# EasyEDA schematic SCH_Octoslime_2022-08-10_Schematics.json

## Sheets
1 I2C breakout and OLED: TITLE: I2C expander to RJ45 and OLED; REV: 1.0; Date: 2022-07-19; Sheet: 1/4; Company: Your Company
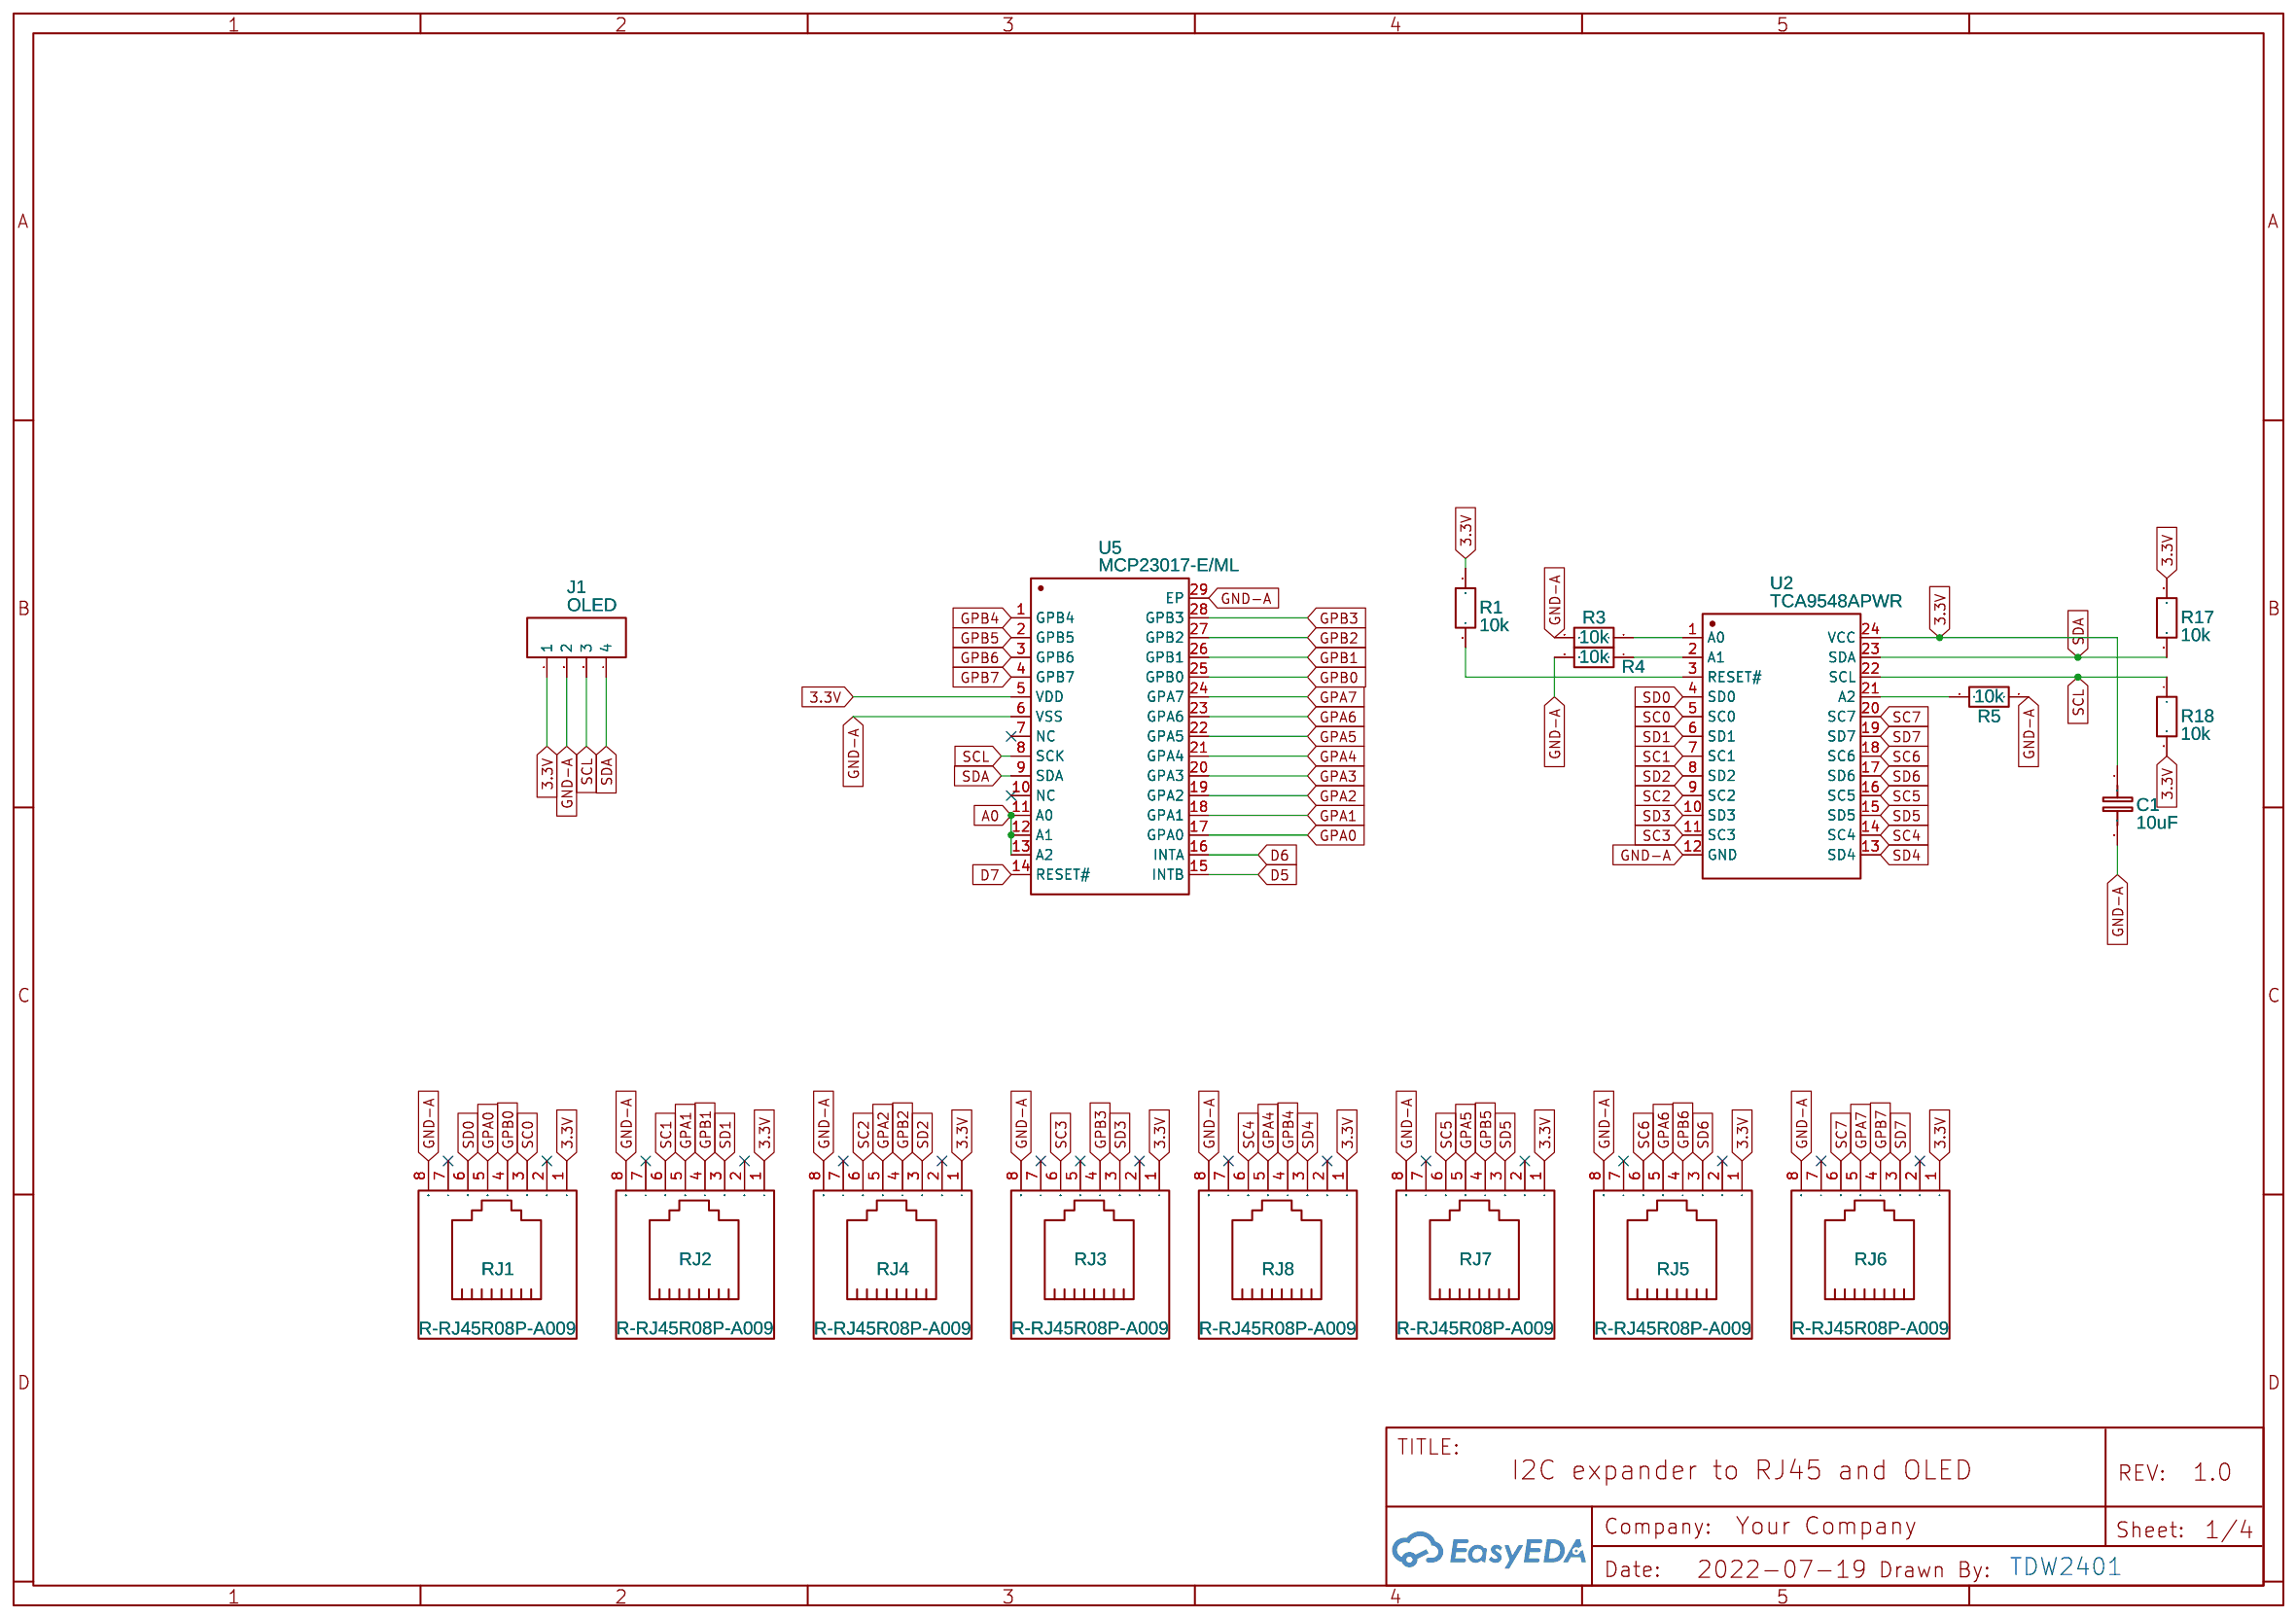
[diagram p0: I2C breakout and OLED]
2 Charge / data: TITLE: Charge and data; Sheet: 2/4
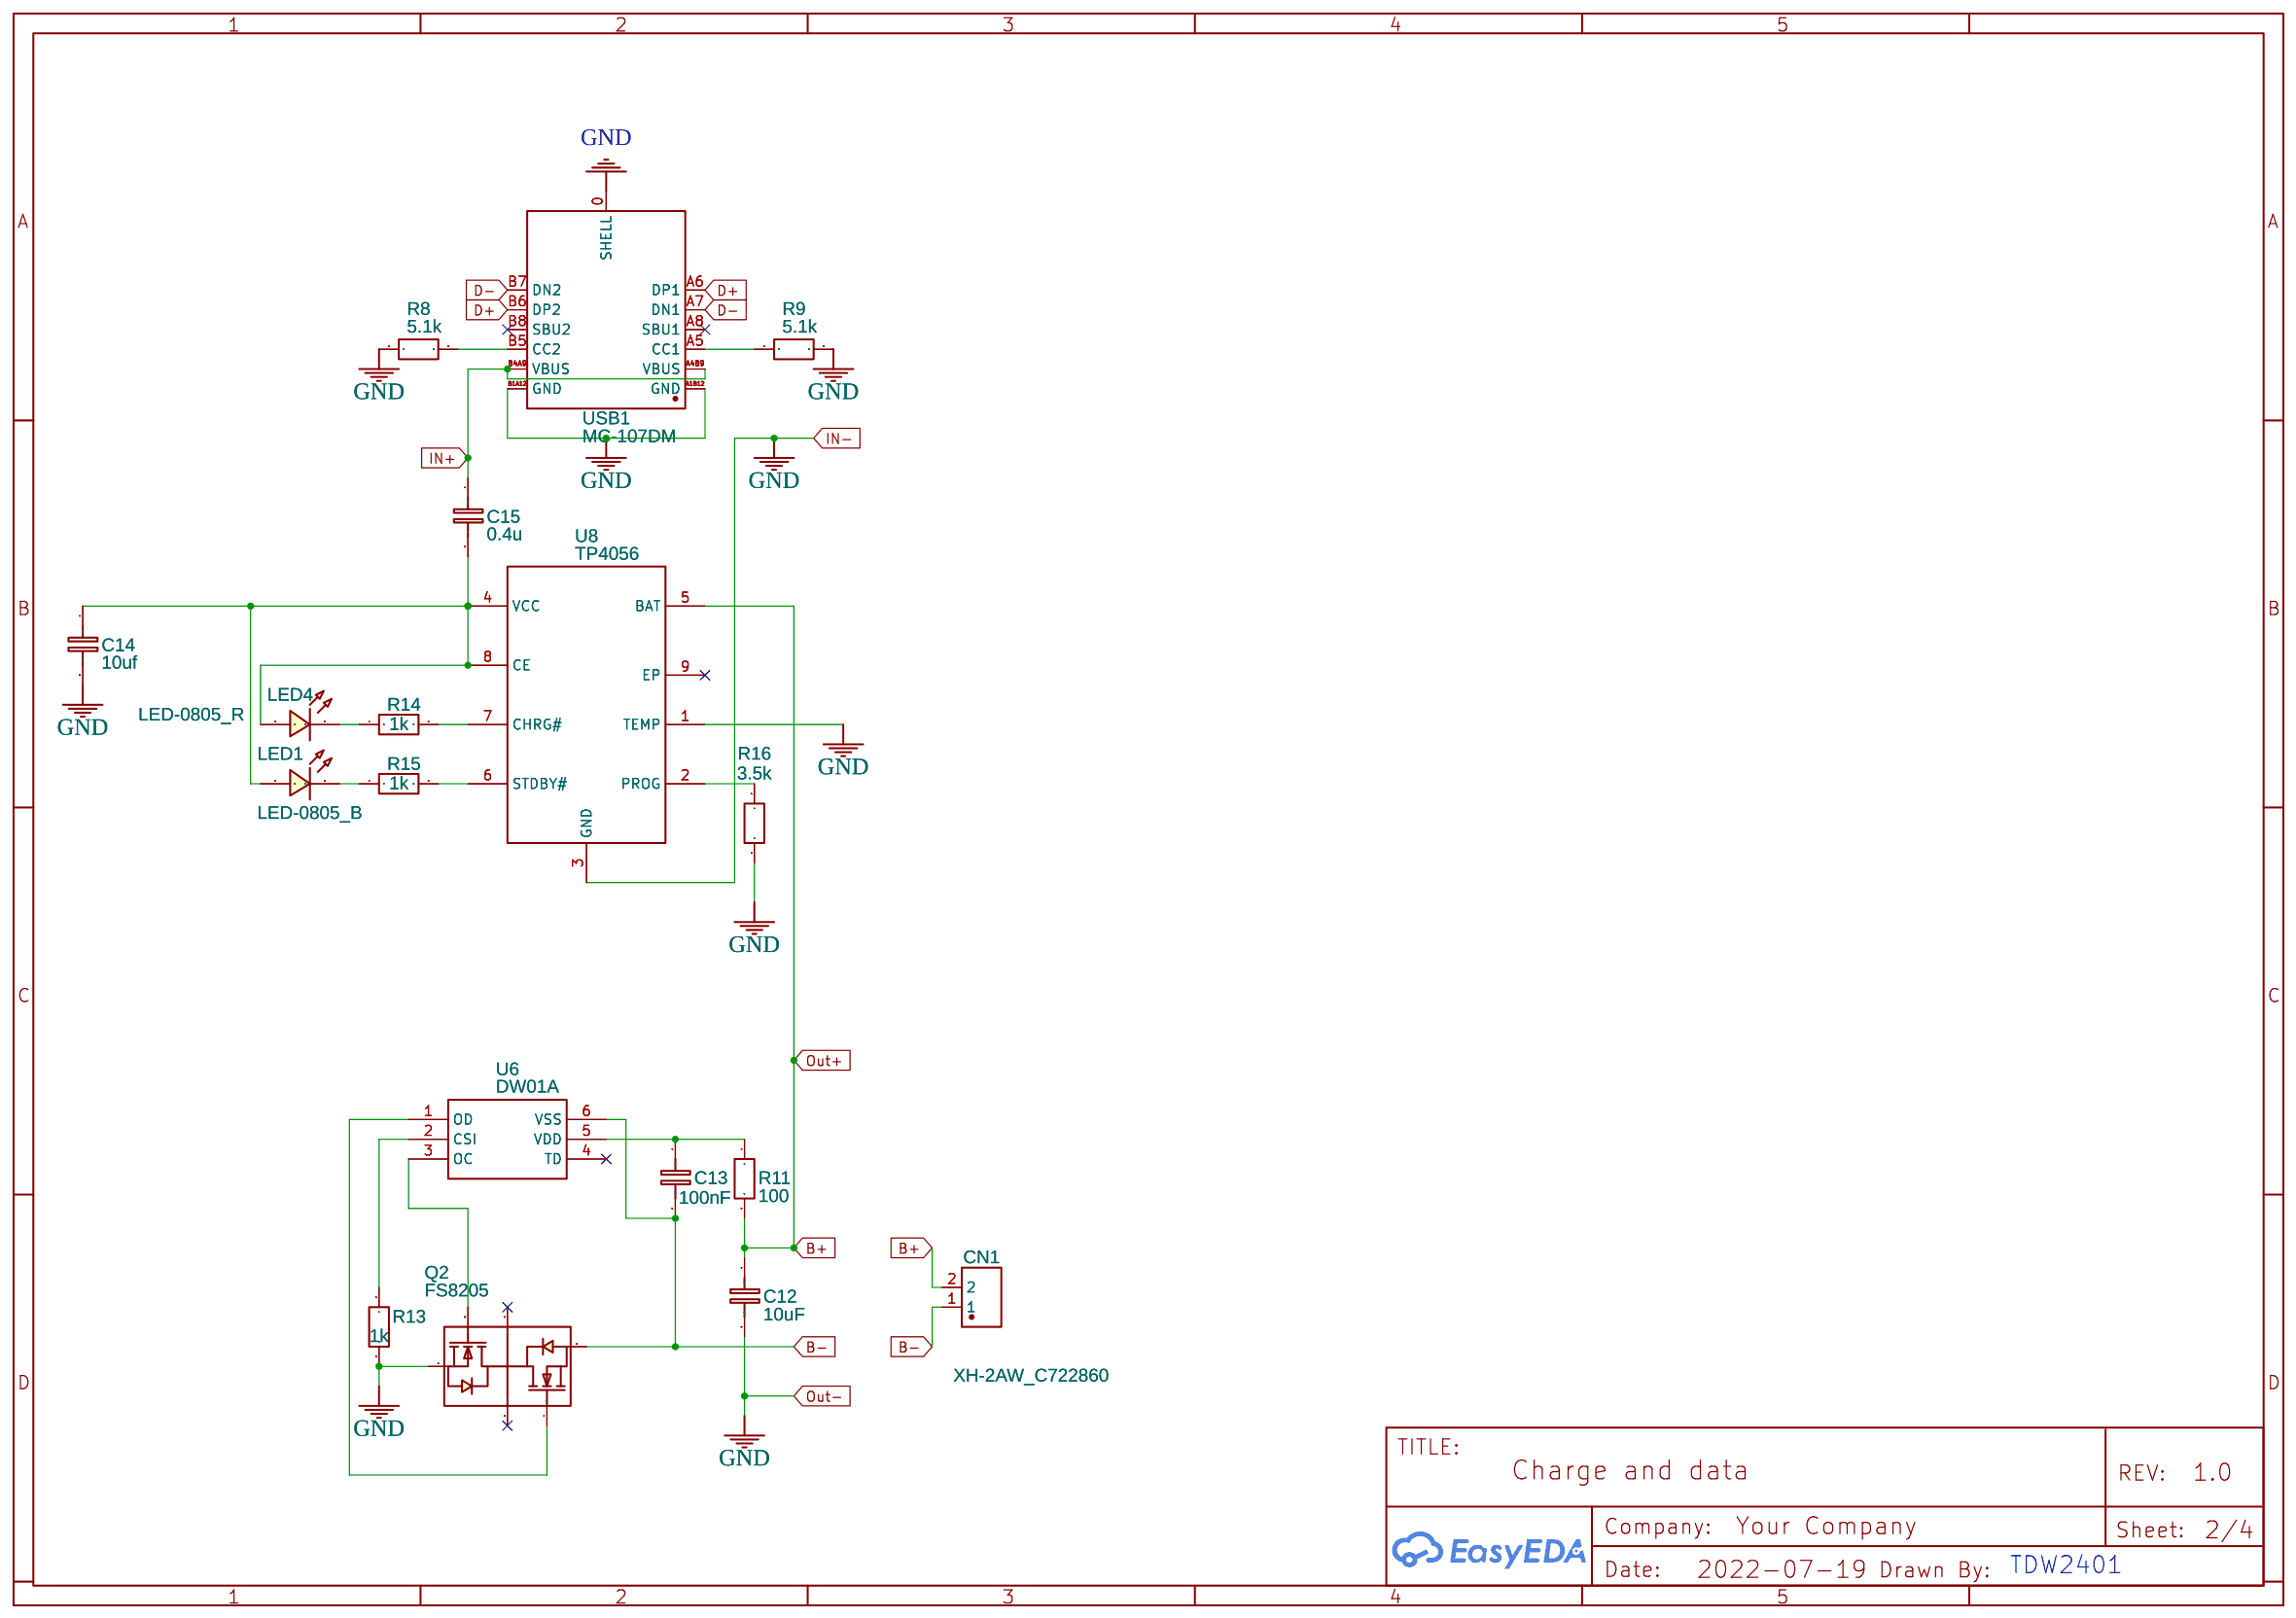
[diagram p1: Charge / data]
3 MCU: TITLE: MCU; Date: 2022-07-22; Sheet: 3/4; Drawn By: TDW2401; Company: SSG
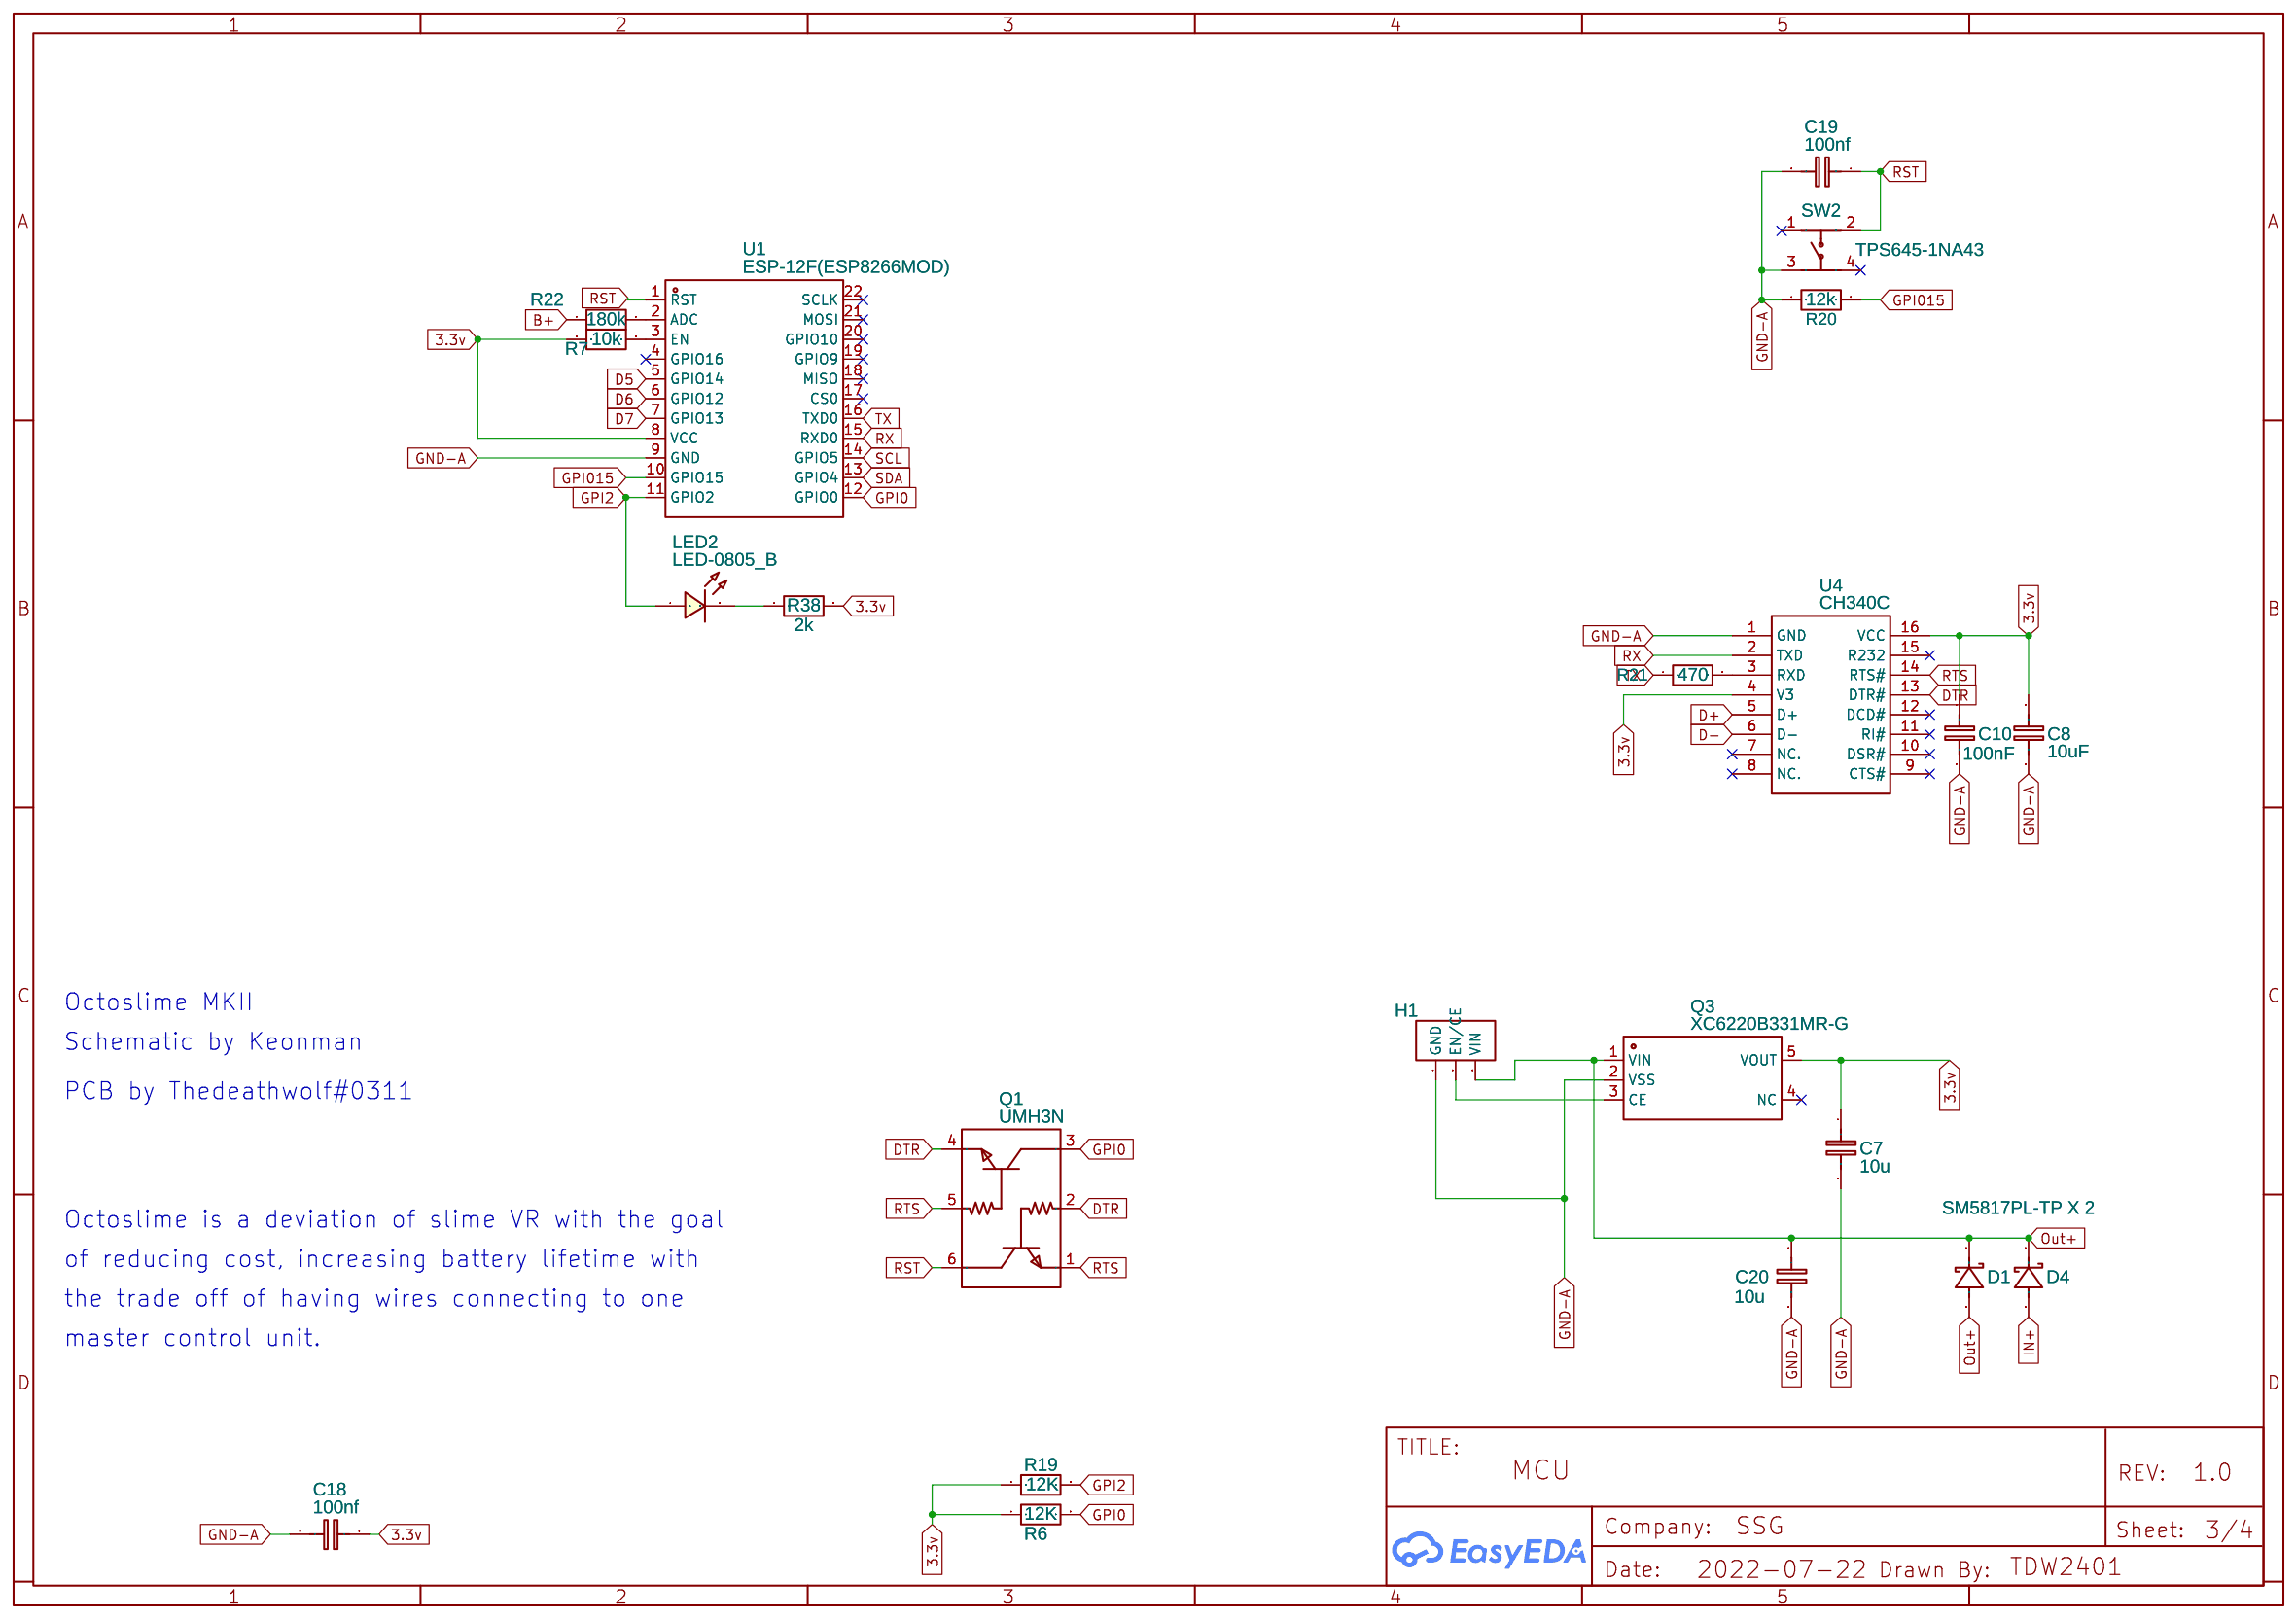
[diagram p2: MCU]
4 I2C thing - ma - jigXC6220B331PR-G: TITLE: I2C bus conditioner; Date: 2022-07-22; Sheet: 4/4; Drawn By: TDW2401
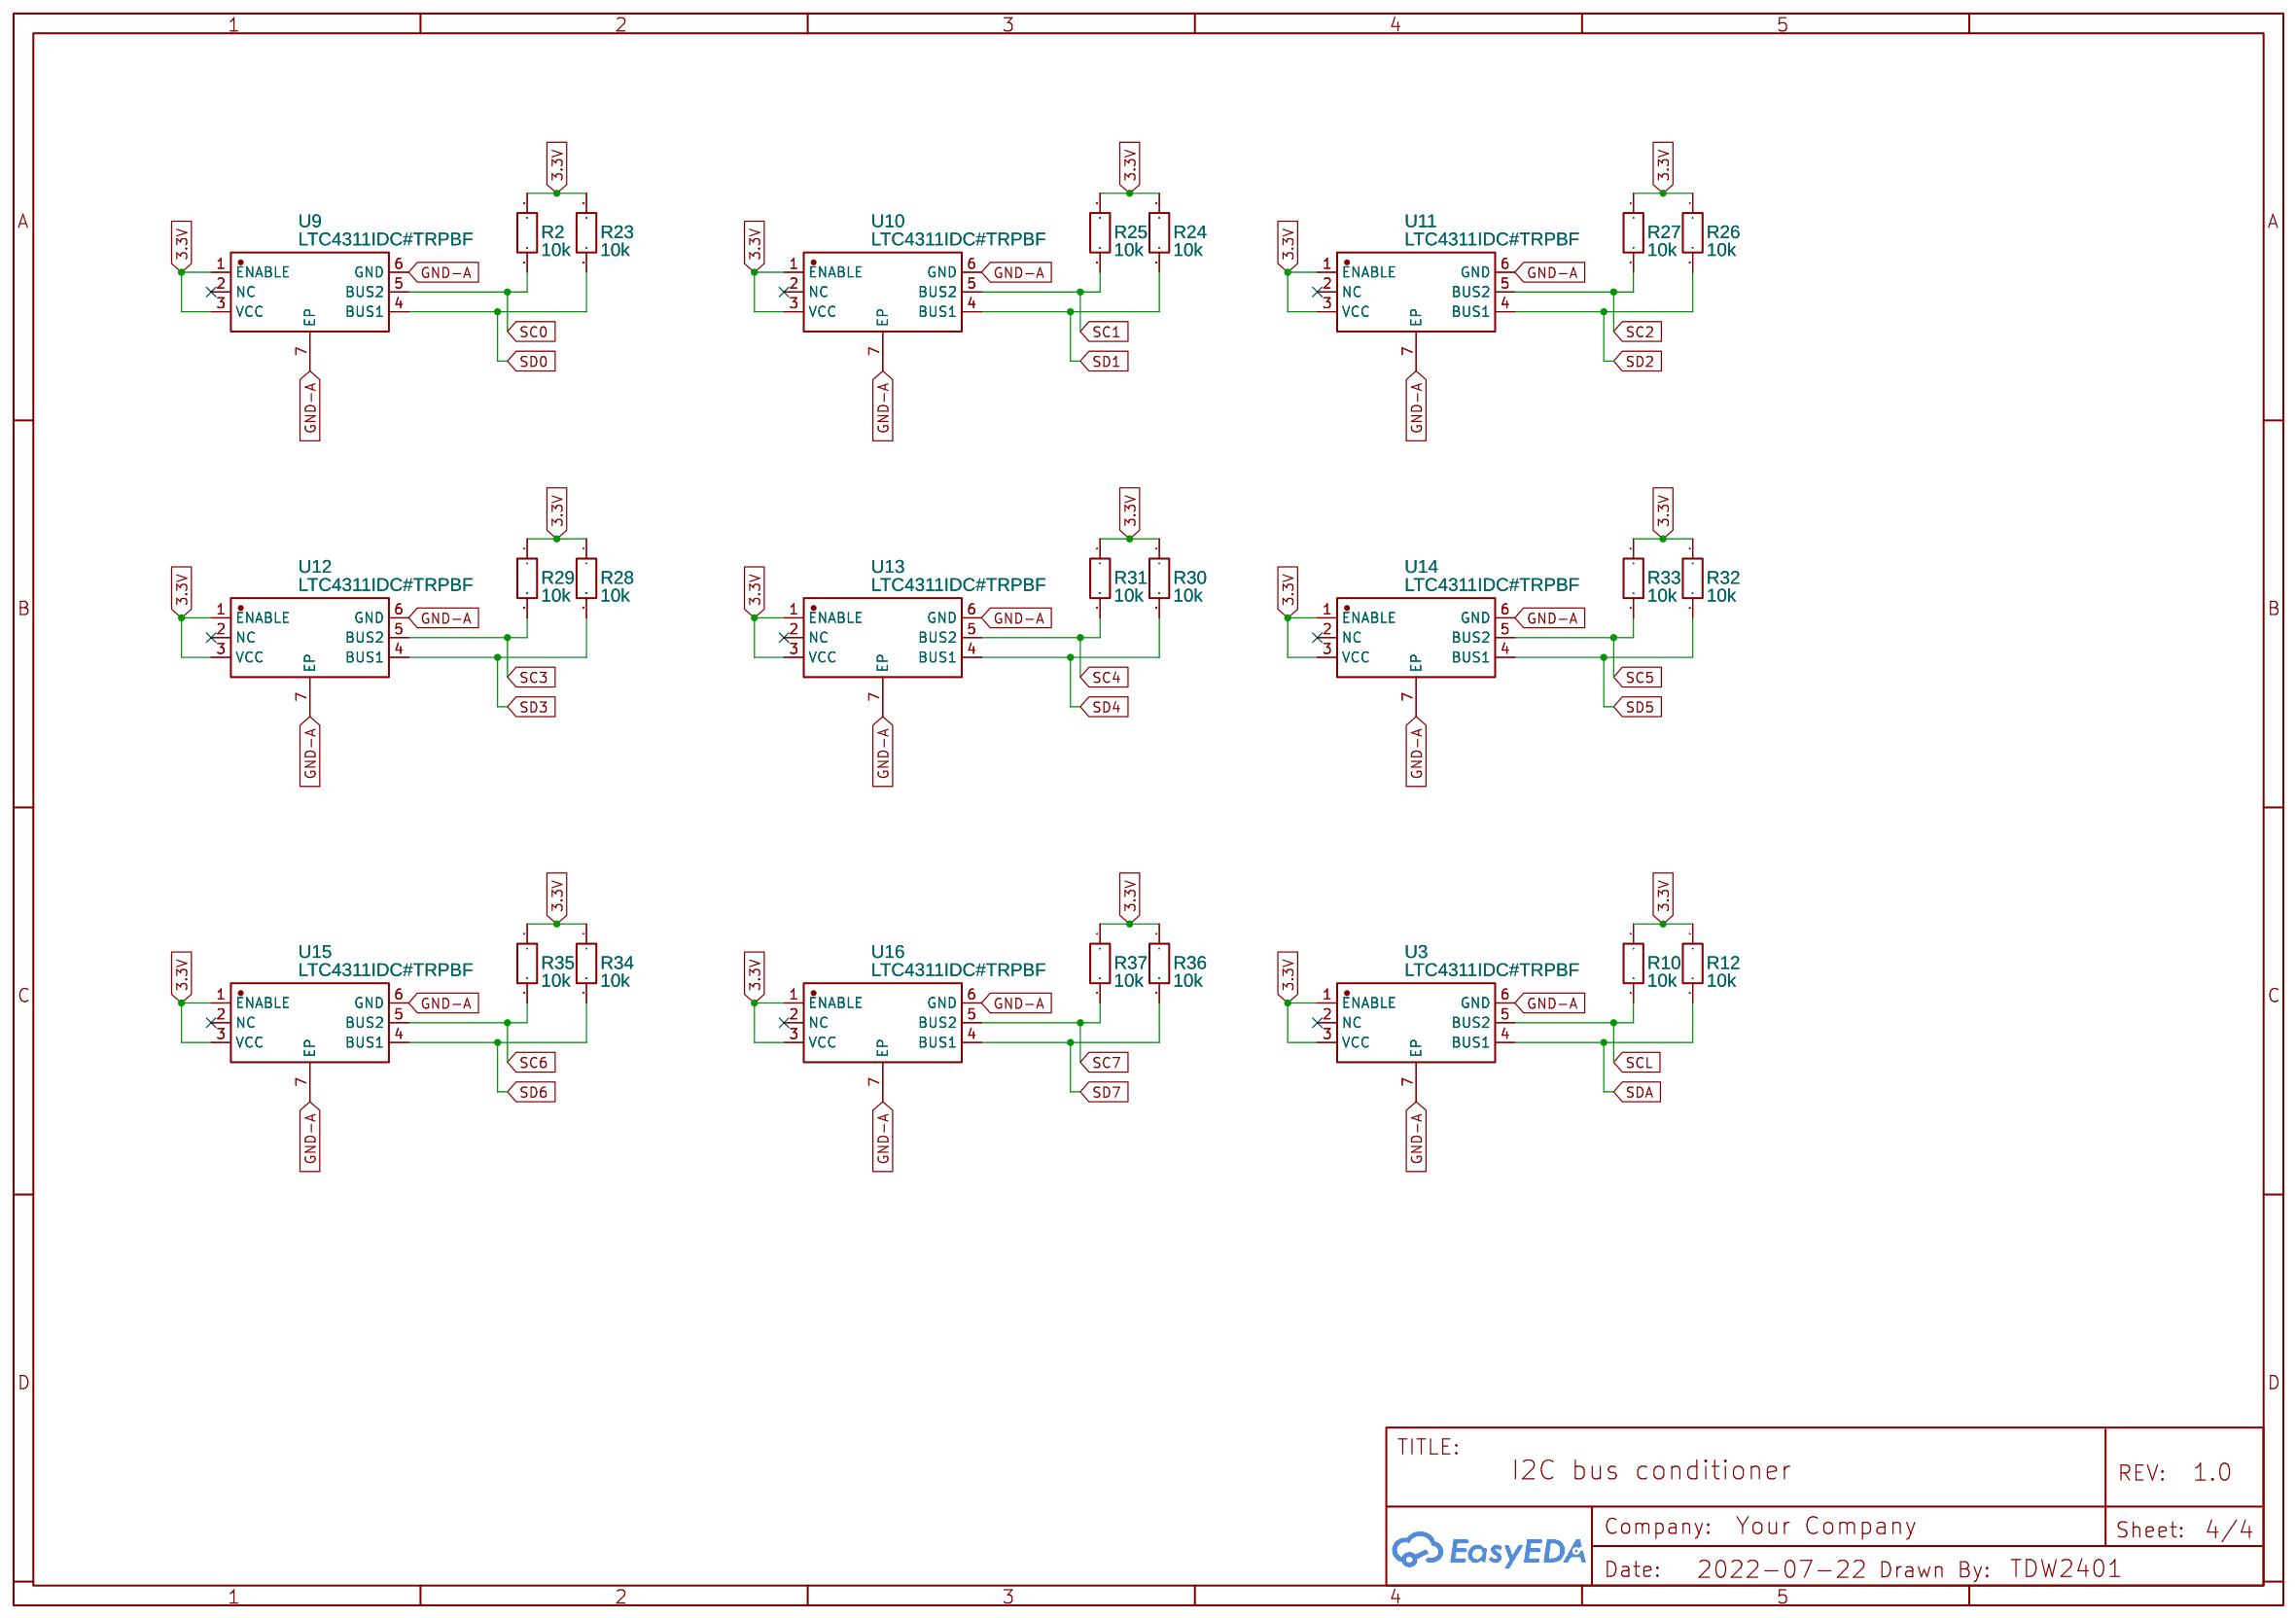
[diagram p3: I2C thing - ma - jigXC6220B331PR-G]

## Parts
sheet Charge / data
C12  10uF  [C0805]
C13  100nF  [C0805]
C14  10uf  [C0805]
C15  0.4u  [C0805]
CN1  XH-2AW_C722860  [CONN-TH_XH-2AW_C722860]
LED1  LED-0805_B  [LED0805_BLUE]
LED4  LED-0805_R  [LED0805_RED]
Q2  FS8205  [SOT-23-6_L2.9-W1.6-P0.95-LS2.8-BR]
R8  5.1k  [R0805]
R9  5.1k  [R0805]
R11  100  [R0805]
R13  1k  [R0805]
R14  1k  [R0805]
R15  1k  [R0805]
R16  3.5k  [R0805]
U6  DW01A  [SOT-23-6_L2.9-W1.6-P0.95-LS2.8-BL]
U8  TP4056  [ESOP-8_L4.9-W3.9-P1.27-LS6.0-BL-EP]
USB1  MC-107DM  [USB-C-SMD_MC-107D]
sheet I2C breakout and OLED
C1  10uF  [C0805]
J1  OLED  [HDR-M-2.54_1X4]
R1  10k  [R0805]
R3  10k  [R0805]
R4  10k  [R0805]
R5  10k  [R0805]
R17  10k  [R0805]
R18  10k  [R0805]
RJ1  R-RJ45R08P-A009  [RJ45-TH_R-RJ45R08P-A009]
RJ2  R-RJ45R08P-A009  [RJ45-TH_R-RJ45R08P-A009]
RJ3  R-RJ45R08P-A009  [RJ45-TH_R-RJ45R08P-A009]
RJ4  R-RJ45R08P-A009  [RJ45-TH_R-RJ45R08P-A009]
RJ5  R-RJ45R08P-A009  [RJ45-TH_R-RJ45R08P-A009]
RJ6  R-RJ45R08P-A009  [RJ45-TH_R-RJ45R08P-A009]
RJ7  R-RJ45R08P-A009  [RJ45-TH_R-RJ45R08P-A009]
RJ8  R-RJ45R08P-A009  [RJ45-TH_R-RJ45R08P-A009]
U2  TCA9548APWR  [TSSOP-24_L7.8-W4.4-P0.65-LS6.4-BL]
U5  MCP23017-E/ML  [QFN-28_L6.0-W6.0-P0.65-BL-EP3.7]
sheet I2C thing - ma - jigXC6220B331PR-G
R2  10k  [R0805]
R10  10k  [R0805]
R12  10k  [R0805]
R23  10k  [R0805]
R24  10k  [R0805]
R25  10k  [R0805]
R26  10k  [R0805]
R27  10k  [R0805]
R28  10k  [R0805]
R29  10k  [R0805]
R30  10k  [R0805]
R31  10k  [R0805]
R32  10k  [R0805]
R33  10k  [R0805]
R34  10k  [R0805]
R35  10k  [R0805]
R36  10k  [R0805]
R37  10k  [R0805]
U3  LTC4311IDC#TRPBF  [DFN-6_L2.0-W2.0-P0.50-BL-EP]
U9  LTC4311IDC#TRPBF  [DFN-6_L2.0-W2.0-P0.50-BL-EP]
U10  LTC4311IDC#TRPBF  [DFN-6_L2.0-W2.0-P0.50-BL-EP]
U11  LTC4311IDC#TRPBF  [DFN-6_L2.0-W2.0-P0.50-BL-EP]
U12  LTC4311IDC#TRPBF  [DFN-6_L2.0-W2.0-P0.50-BL-EP]
U13  LTC4311IDC#TRPBF  [DFN-6_L2.0-W2.0-P0.50-BL-EP]
U14  LTC4311IDC#TRPBF  [DFN-6_L2.0-W2.0-P0.50-BL-EP]
U15  LTC4311IDC#TRPBF  [DFN-6_L2.0-W2.0-P0.50-BL-EP]
U16  LTC4311IDC#TRPBF  [DFN-6_L2.0-W2.0-P0.50-BL-EP]
sheet MCU
C7  10u  [C0805]
C8  10uF  [C0805]
C10  100nF  [C0805]
C18  100nf  [C0805]
C19  100nf  [C0805]
C20  10u  [C0805]
D1  SM5817PL-TP X 2  [SOD-123FL_L2.8-W1.7-LS3.6-RD]
D4  SM5817PL-TP X 2  [SOD-123FL_L2.8-W1.7-LS3.6-RD]
H1  HDR-F-2.54_1x3  [HDR-F-2.54_1X3]
LED2  LED-0805_B  [LED0805_BLUE]
Q1  UMH3N  [SC-70-6_L2.2-W1.3-P0.65-LS2.1-BR]
Q3  XC6220B331MR-G  [SOT-25-5_L3.0-W1.8-P0.95-LS3.0-BR]
R6  12K  [R0805]
R7  10k  [R0805]
R19  12K  [R0805]
R20  12k  [R0805]
R21  470  [R0805]
R22  180k  [R0805]
R38  2k  [R0805]
SW2  TPS645-1NA43  [SW-TH_4P-L6.0-W6.0-P4.50-LS6.5]
U1  ESP-12F(ESP8266MOD)  [WIFIM-SMD_ESP-12F-ESP8266MOD]
U4  CH340C  [SOP-16_L10.0-W3.9-P1.27-LS6.0-BL]

## Library data of the parts
C1 C7 C8 C10 C12-C15 C18-C20 = C_0805_EU: Contributor: LCEDA_Lib
CN1 = XH-2AW_C722860: Supplier: LCSC; Supplier Part: C722860; Manufacturer: CAX; Manufacturer Part: XH-2AW; Contributor: LCSC; JLCPCB Part Class: Extended Part
LED1 LED2 = LED-0805_B: Manufacturer: 方舟 ARKLED; Manufacturer Part: D-B080508B1-KS2; Supplier Part: C108412; Contributor: LCEDA_Lib
LED4 = LED-0805_R: Manufacturer: EVERLIGHT(台湾亿光); Manufacturer Part: 17-21SURC/S530-A3/TR8; Supplier Part: C72037; Contributor: LCEDA_Lib
Q2 = FS8205: Supplier: LCSC; Manufacturer: FORTUNE; Supplier Part: C32254; JLCPCB Part Class: Extended Part
R1-R38 = R_0805_EU: Contributor: LCEDA_Lib
U6 = DW01A: Supplier: LCSC; Manufacturer: FM; Supplier Part: C85680; JLCPCB Part Class: Extended Part
U8 = TP4056: Contributor: Guest; Supplier: LCSC; Manufacturer: TOPPOWER; Supplier Part: C16581; JLCPCB Part Class: Basic Part
USB1 = MC-107DM: Supplier: LCSC; Supplier Part: C2874569; Manufacturer: 台湾汉博; JLCPCB Part Class: Extended Part; Contributor: LCSC
J1 = HDR-M-2.54_1x4: Supplier Part: C124378; Supplier: LCSC; Contributor: LCEDA_Lib
RJ1-RJ8 = R-RJ45R08P-A009: Supplier: LCSC; Supplier Part: C2902700; Manufacturer: Ckmtw(灿科盟); Contributor: LCSC; JLCPCB Part Class: Extended Part
U2 = TCA9548APWR: Supplier: LCSC; Manufacturer: TI; Supplier Part: C130026; JLCPCB Part Class: Extended Part
U5 = MCP23017-E/ML: Supplier: LCSC; Supplier Part: C639770; Manufacturer: MICROCHIP(美国微芯); JLCPCB Part Class: Extended Part; Contributor: LCSC
U3 U9-U16 = LTC4311IDC#TRPBF: Supplier: LCSC; Supplier Part: C688096; Manufacturer: Analog Devices; Contributor: LCSC; JLCPCB Part Class: Extended Part
D1 D4 = SM5817PL-TP: Supplier: LCSC; Supplier Part: C669022; Manufacturer: MCC(Micro Commercial Components); Contributor: LCSC; JLCPCB Part Class: Extended Part
H1 = HDR-F-2.54_1x3: Supplier Part: C146690; Supplier: LCSC; Contributor: LCEDA_Lib
Q1 = UMH3N: Supplier: LCSC; Manufacturer: CJ; Supplier Part: C62892; JLCPCB Part Class: Extended Part
Q3 = XC6220B331MR-G: Supplier: LCSC; Manufacturer: TOREX; Supplier Part: C86534; JLCPCB Part Class: Extended Part
SW2 = TPS645-1NA43: Supplier: LCSC; Supplier Part: C2828575; Manufacturer: ROCPU(台普); Contributor: LCSC; JLCPCB Part Class: Extended Part
U1 = ESP-12F(ESP8266MOD): Supplier: LCSC; Manufacturer: Ai-Thinker; Supplier Part: C82891; JLCPCB Part Class: Extended Part
U4 = CH340C: Supplier: LCSC; Manufacturer: WCH; Supplier Part: C84681; JLCPCB Part Class: Extended Part

## Nets
3.3V: C1.1 J1.1 R1.1 R2.1 R10.1 R12.1 R17.1 R18.2 R23.1 R24.1 R25.1 R26.1 R27.1 R28.1 R29.1 R30.1 R31.1 R32.1 R33.1 R34.1 R35.1 R36.1 R37.1 RJ1.1 RJ2.1 RJ3.1 RJ4.1 RJ5.1 RJ6.1 RJ7.1 RJ8.1 U2.24(VCC) U3.1(ENABLE) U3.3(VCC) U5.5(VDD) U9.1(ENABLE) U9.3(VCC) U10.1(ENABLE) U10.3(VCC) U11.1(ENABLE) U11.3(VCC) U12.1(ENABLE) U12.3(VCC) U13.1(ENABLE) U13.3(VCC) U14.1(ENABLE) U14.3(VCC) U15.1(ENABLE) U15.3(VCC) U16.1(ENABLE) U16.3(VCC)
3.3v: C7.1 C8.1 C10.1 C18.1 Q3.5(VOUT) R6.1 R7.1 R19.1 R38.2 U1.8(VCC) U4.4(V3) U4.16(VCC)
GND: C12.2 C14.2 Q2.1(S1) R8.1 R9.2 R13.2 R16.2 U8.1(TEMP) U8.3(GND) USB1.0(SHELL) USB1.A1B12(GND) USB1.B1A12(GND)
GND-A: C1.2 C7.2 C8.2 C10.2 C18.2 C19.2 C20.2 H1.1(GND) J1.2 Q3.2(VSS) R3.2 R4.2 R5.1 R20.1 RJ1.8 RJ2.8 RJ3.8 RJ4.8 RJ5.8 RJ6.8 RJ7.8 RJ8.8 SW2.3 U1.9(GND) U2.12(GND) U3.6(GND) U3.7(EP) U4.1(GND) U5.6(VSS) U5.29(EP) U9.6(GND) U9.7(EP) U10.6(GND) U10.7(EP) U11.6(GND) U11.7(EP) U12.6(GND) U12.7(EP) U13.6(GND) U13.7(EP) U14.6(GND) U14.7(EP) U15.6(GND) U15.7(EP) U16.6(GND) U16.7(EP)
A0: U5.11(A0) U5.12(A1) U5.13(A2)
B+: C12.1 C20.1 CN1.2 D1.1(C) D1.2(A) D4.1(C) H1.3(VIN) Q3.1(VIN) R11.2 R22.1 U8.5(BAT)
B-: C13.2 CN1.1 Q2.3(S2) U6.6(VSS)
D5: U1.5(GPIO14) U5.15(INTB)
D6: U1.6(GPIO12) U5.16(INTA)
D7: U1.7(GPIO13) U5.14(RESET#)
D+: U4.5(D+) USB1.A6(DP1) USB1.B6(DP2)
D-: U4.6(D-) USB1.A7(DN1) USB1.B7(DN2)
DTR: Q1.2(B) Q1.4(E) U4.13(DTR#)
GPA0: RJ1.5 U5.17(GPA0)
GPA1: RJ2.5 U5.18(GPA1)
GPA2: RJ4.5 U5.19(GPA2)
GPA3: U5.20(GPA3)
GPA4: RJ8.5 U5.21(GPA4)
GPA5: RJ7.5 U5.22(GPA5)
GPA6: RJ5.5 U5.23(GPA6)
GPA7: RJ6.5 U5.24(GPA7)
GPB0: RJ1.4 U5.25(GPB0)
GPB1: RJ2.4 U5.26(GPB1)
GPB2: RJ4.4 U5.27(GPB2)
GPB3: RJ3.4 U5.28(GPB3)
GPB4: RJ8.4 U5.1(GPB4)
GPB5: RJ7.4 U5.2(GPB5)
GPB6: RJ5.4 U5.3(GPB6)
GPB7: RJ6.4 U5.4(GPB7)
GPI0: Q1.3(C) R6.2 U1.12(GPIO0)
GPI2: LED2.1 R19.2 U1.11(GPIO2)
GPI015: R20.2 U1.10(GPIO15)
IN+: C15.1 D4.2(A) USB1.A4B9(VBUS) USB1.B4A9(VBUS)
RST: C19.1 Q1.6(C) SW2.2 U1.1(RST)
RTS: Q1.1(E) Q1.5(B) U4.14(RTS#)
RX: U1.15(RXD0) U4.2(TXD)
SC0: R2.2 RJ1.3 U2.5(SC0) U9.5(BUS2)
SC1: R25.2 RJ2.6 U2.7(SC1) U10.5(BUS2)
SC2: R27.2 RJ4.6 U2.9(SC2) U11.5(BUS2)
SC3: R29.2 RJ3.6 U2.11(SC3) U12.5(BUS2)
SC4: R31.2 RJ8.6 U2.14(SC4) U13.5(BUS2)
SC5: R33.2 RJ7.6 U2.16(SC5) U14.5(BUS2)
SC6: R35.2 RJ5.6 U2.18(SC6) U15.5(BUS2)
SC7: R37.2 RJ6.6 U2.20(SC7) U16.5(BUS2)
SCL: J1.3 R10.2 R18.1 U1.14(GPIO5) U2.22(SCL) U3.5(BUS2) U5.8(SCK)
SD0: R23.2 RJ1.6 U2.4(SD0) U9.4(BUS1)
SD1: R24.2 RJ2.3 U2.6(SD1) U10.4(BUS1)
SD2: R26.2 RJ4.3 U2.8(SD2) U11.4(BUS1)
SD3: R28.2 RJ3.3 U2.10(SD3) U12.4(BUS1)
SD4: R30.2 RJ8.3 U2.13(SD4) U13.4(BUS1)
SD5: R32.2 RJ7.3 U2.15(SD5) U14.4(BUS1)
SD6: R34.2 RJ5.3 U2.17(SD6) U15.4(BUS1)
SD7: R36.2 RJ6.3 U2.19(SD7) U16.4(BUS1)
SDA: J1.4 R12.2 R17.2 U1.13(GPIO4) U2.23(SDA) U3.4(BUS1) U5.9(SDA)
TX: R21.1 U1.16(TXD0)
Net-(C13-1): C13.1 R11.1 U6.5(VDD)
Net-(C14-1): C14.1 C15.2 LED1.1 LED4.1 U8.4(VCC) U8.8(CE)
Net-(H1-2): H1.2(EN/CE) Q3.3(CE)
Net-(LED1-2): LED1.2 R15.1
Net-(LED2-2): LED2.2 R38.1
Net-(LED4-2): LED4.2 R14.1
Net-(Q2-4): Q2.4(G2) U6.1(OD)
Net-(Q2-6): Q2.6(G1) U6.3(OC)
Net-(R1-2): R1.2 U2.3(RESET#)
Net-(R3-1): R3.1 U2.1(A0)
Net-(R4-1): R4.1 U2.2(A1)
Net-(R5-2): R5.2 U2.21(A2)
Net-(R7-2): R7.2 U1.3(EN)
Net-(R8-2): R8.2 USB1.B5(CC2)
Net-(R9-1): R9.1 USB1.A5(CC1)
Net-(R13-1): R13.1 U6.2(CSI)
Net-(R14-2): R14.2 U8.7(CHRG#)
Net-(R15-2): R15.2 U8.6(STDBY#)
Net-(R16-1): R16.1 U8.2(PROG)
Net-(R21-2): R21.2 U4.3(RXD)
Net-(R22-2): R22.2 U1.2(ADC)

Not connected (* = marked no-connect by the designer): Q2 2(D12)* 5(D12)*; Q3 4(NC)*; RJ1 2* 7*; RJ2 2* 7*; RJ3 2* 5* 7*; RJ4 2* 7*; RJ5 2* 7*; RJ6 2* 7*; RJ7 2* 7*; RJ8 2* 7*; SW2 1* 4*; U1 4(GPIO16)* 17(CS0)* 18(MISO)* 19(GPIO9)* 20(GPIO10)* 21(MOSI)* 22(SCLK)*; U3 2(NC)*; U4 7(NC.)* 8(NC.)* 9(CTS#)* 10(DSR#)* 11(RI#)* 12(DCD#)* 15(R232)*; U5 7(NC)* 10(NC)*; U6 4(TD)*; U8 9(EP)*; U9 2(NC)*; U10 2(NC)*; U11 2(NC)*; U12 2(NC)*; U13 2(NC)*; U14 2(NC)*; U15 2(NC)*; U16 2(NC)*; USB1 A8(SBU1)* B8(SBU2)*

## Notes on the sheets
sheet 1
- TDW2401
sheet 2
- TDW2401
sheet 3
- Octoslime MKII
- Schematic by Keonman
- PCB by Thedeathwolf#0311
- Octoslime is a deviation of slime VR with the goal
- of reducing cost, increasing battery lifetime with
- the trade off of having wires connecting to one
- master control unit.
